# EAGLE design box1LEDS (EAGLE 7.2.0)
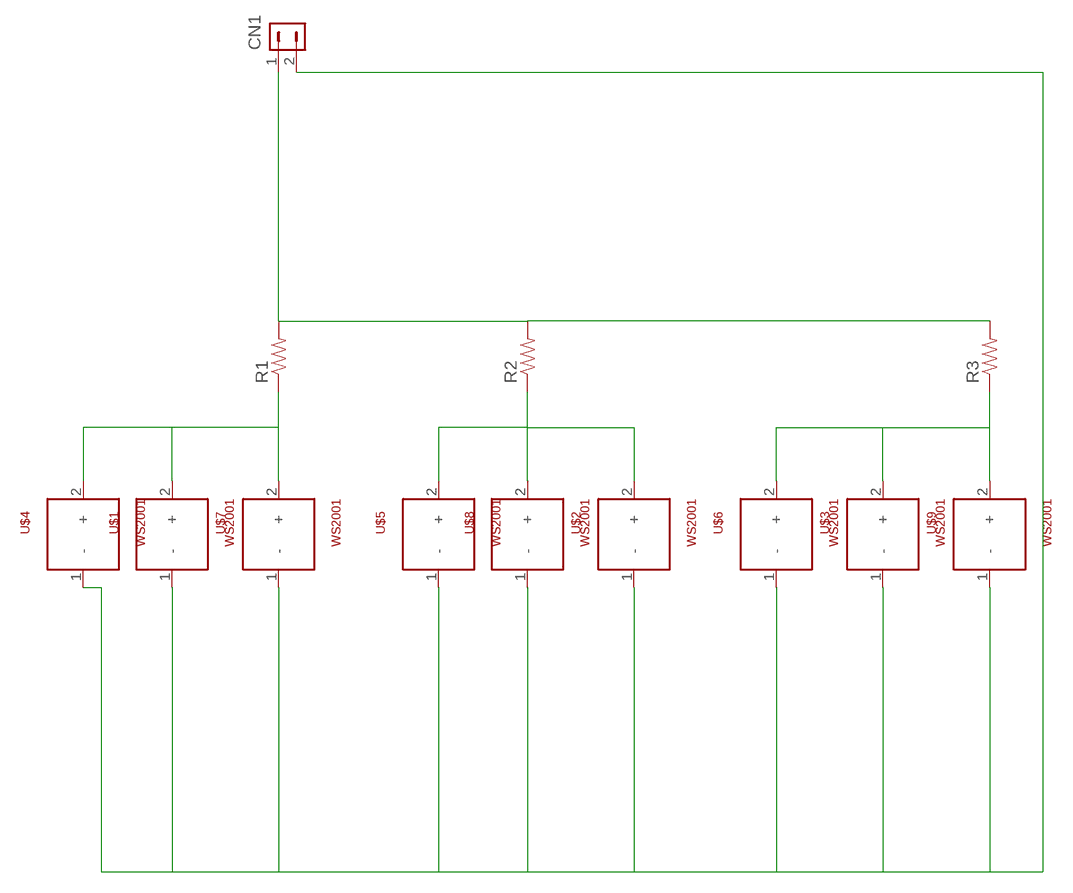
[diagram p0: schematic, sheet 1]

## Parts
CN1  HDR-1X2-SIP-100  [SIP-100-2V]
R1  RESISTORPTH-1/4W  [AXIAL-0.4]
R2  RESISTORPTH-1/4W  [AXIAL-0.4]
R3  RESISTORPTH-1/4W  [AXIAL-0.4]
U$1  WS2001  [WH2001]
U$2  WS2001  [WH2001]
U$3  WS2001  [WH2001]
U$4  WS2001  [WH2001]
U$5  WS2001  [WH2001]
U$6  WS2001  [WH2001]
U$7  WS2001  [WH2001]
U$8  WS2001  [WH2001]
U$9  WS2001  [WH2001]

## Nets
GND: CN1.2 U$1.1(-) U$2.1(-) U$3.1(-) U$4.1(-) U$5.1(-) U$6.1(-) U$7.1(-) U$8.1(-) U$9.1(-)
N$1: R3.P$1 U$3.2(+) U$6.2(+) U$9.2(+)
N$2: R2.P$1 U$2.2(+) U$5.2(+) U$8.2(+)
N$3: R1.P$1 U$1.2(+) U$4.2(+) U$7.2(+)
N$5: CN1.1 R1.P$2 R2.P$2 R3.P$2

## Library data of the parts
CN1 = con-hdrs40:HDR-1X2: HEADER CONNECTOR
R1-R3 = SparkFun-Passives:RESISTOR: Resistor Basic schematic elements and footprints for 0603, 1206, and PTH resistors.
U$1-U$9 = wh2001:WS2001

## Net classes
0 Default: width 0.203 mm
1 VCC: width 0.381 mm
2 LEDPower: width 0.203 mm
3 ButtonSignal: width 0.203 mm

## Board
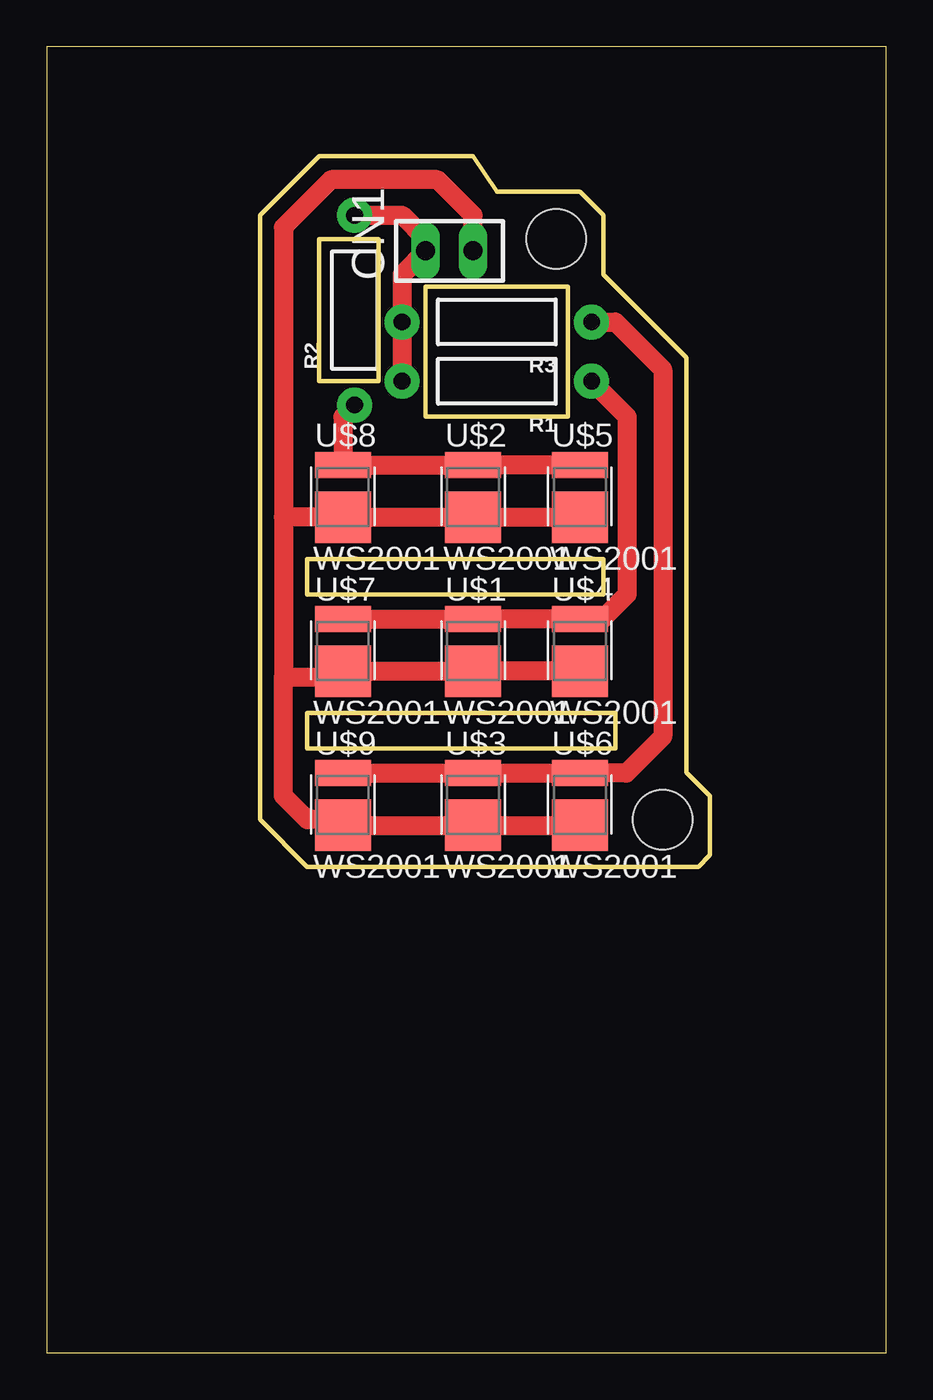
[diagram p1: board, top side]

Size 45 x 70 mm. Coordinates in mm from the lower left corner, seen from the top.
Outline: 0,0 45,0 45,70 0,70 0,0
Outline: 11.43,60.96 11.43,28.57 13.97,26.04 34.92,26.04 35.56,26.67 35.56,29.84 34.29,31.11 34.29,53.34 29.84,57.78 29.84,60.96 28.57,62.23 24.13,62.23 22.86,64.14 14.61,64.14 11.43,60.96
Outline: 29.84,42.55 13.97,42.55 13.97,40.64 29.84,40.64 29.84,42.55
Outline: 30.48,34.29 13.97,34.29 13.97,32.38 30.48,32.38 30.48,34.29
Outline: 14.61,59.69 17.78,59.69 17.78,52.07 14.61,52.07 14.61,59.69
Outline: 20.32,57.15 27.94,57.15 27.94,50.16 20.32,50.16 20.32,57.15
Copper layers (1*16): Top 0.035mm / dielectric 1.5mm / Bottom 0.035mm
Design rules "default": minimum track width 10mil, minimum drill 24mil, track to track 8mil, track to pad 8mil, pad to pad 8mil, via to via 8mil, smd to smd 8mil, copper to edge 40mil, drill to drill 8mil, minimum pad ring 10mil, minimum via ring 8mil, stop-mask expansion 4mil, vias tented up to drill 0mil, thermal gap 10mil
Holes 3.2 mm at 33.02,28.57 27.3,59.69

### Footprints (pad centres in the part's own frame; a part is rotated, then mirrored left to right if it is on the bottom)
SIP-100-2V = drill 1.016 long: 1 -1.27,0; 2 1.27,0
AXIAL-0.4 = drill 0.9 pad 1.88: P$1 -5.08,0; P$2 5.08,0
WH2001 = smd 3 x 2.75: 1 0,-1.57 | smd 3 x 1.396: 2 0,1.224

### Placement (x,y rotation side)
CN1  21.59,59.05 0 top
R1  24.13,52.07 180 top
R2  16.51,55.88 90 top
R3  24.13,55.24 180 top
U$1  22.86,38.1 0 top
U$2  22.86,46.35 0 top
U$3  22.86,29.84 0 top
U$4  28.57,38.1 0 top
U$5  28.57,46.35 0 top
U$6  28.57,29.84 0 top
U$7  15.88,38.1 0 top
U$8  15.88,46.35 0 top
U$9  15.88,29.84 0 top

### Tracks (layer width: path | path; a pad name or v marks a point on that pad's centre or on a via)
GND
  Top 0.254: 15.54,28.57 U$9.1 | 15.77,36.12 U$7.1 15.54,36.8 | 15.77,44.35 U$8.1
  Top 1.016: U$9.1 U$3.1 U$6.1 | U$7.1 U$1.1 U$4.1 | U$5.1 U$2.1 U$8.1 15.86,44.8 12.7,44.8 | 15.54,28.57 13.97,28.57 12.7,29.84 12.7,36.2 | 15.77,36.12 15.7,36.2 12.7,36.2 | CN1.2 22.86,60.96 20.95,62.87 15.24,62.87 12.7,60.33 12.7,44.8 | 12.7,44.8 12.7,36.2
N$1
  Top 1.016: U$9.2 U$3.2 U$6.2 31.07,31.07 33.02,33.02 33.02,52.7 30.48,55.24 R3.P$1
N$2
  Top 1.016: U$5.2 U$2.2 U$8.2 15.88,50.16 R2.P$1
N$3
  Top 1.016: U$7.2 U$1.2 U$4.2 29.8,39.32 31.11,40.64 31.11,50.16 R1.P$1
N$5
  Top 1.016: R2.P$2 19.05,60.96 20.32,59.69 CN1.1 19.05,57.78 R3.P$2 R1.P$2